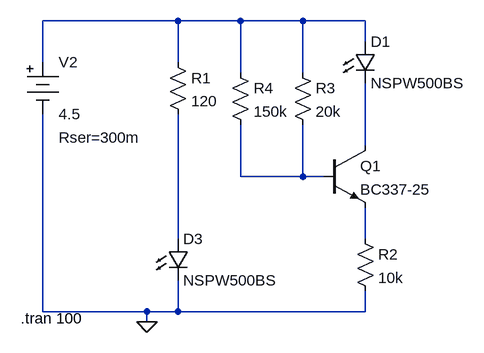
[diagram p0: schematic Draft1.asc]
Draft1.asc, the LTspice schematic file:
Version 4
SHEET 1 880 680
WIRE -96 -128 -304 -128
WIRE 0 -128 -96 -128
WIRE 96 -128 0 -128
WIRE 192 -128 96 -128
WIRE 192 -96 192 -128
WIRE -304 -64 -304 -128
WIRE -96 -64 -96 -128
WIRE 0 -48 0 -128
WIRE 96 -48 96 -128
WIRE 192 64 192 -32
WIRE 0 112 0 32
WIRE 96 112 96 32
WIRE 96 112 0 112
WIRE 128 112 96 112
WIRE -96 208 -96 16
WIRE 192 208 192 160
WIRE -304 320 -304 16
WIRE -144 320 -304 320
WIRE -96 320 -96 272
WIRE -96 320 -144 320
WIRE 192 320 192 288
WIRE 192 320 -96 320
WIRE -144 336 -144 320
FLAG -144 336 0
SYMBOL res -112 -80 R0
SYMATTR InstName R1
SYMATTR Value 120
SYMATTR SpiceLine tol=1
SYMBOL res 176 192 R0
SYMATTR InstName R2
SYMATTR Value 10k
SYMBOL LED 176 -96 R0
SYMATTR InstName D1
SYMATTR Value NSPW500BS
SYMBOL res 80 -64 R0
SYMATTR InstName R3
SYMATTR Value 20k
SYMBOL Misc\\battery -304 -80 R0
WINDOW 123 0 0 Left 0
WINDOW 39 24 132 Left 2
SYMATTR InstName V2
SYMATTR Value 4.5
SYMATTR SpiceLine Rser=300m
SYMBOL npn 128 64 R0
SYMATTR InstName Q1
SYMATTR Value BC337-25
SYMBOL res -16 -64 R0
SYMATTR InstName R4
SYMATTR Value 150k
SYMBOL LED -112 208 R0
SYMATTR InstName D3
SYMATTR Value NSPW500BS
TEXT -338 330 Left 2 !.tran 100

The netlist it stands for:
* Draft1.asc
R1 N001 N004 120 tol=1
R2 N005 0 10k
D1 N001 N002 NSPW500BS
R3 N001 N003 20k
V2 N001 0 4.5 Rser=300m
Q1 N002 N003 N005 0 BC337-25
R4 N001 N003 150k
D3 N004 0 NSPW500BS
.model D D
.lib standard.dio
.model NPN NPN
.model PNP PNP
.lib standard.bjt
.tran 100
.backanno
.end